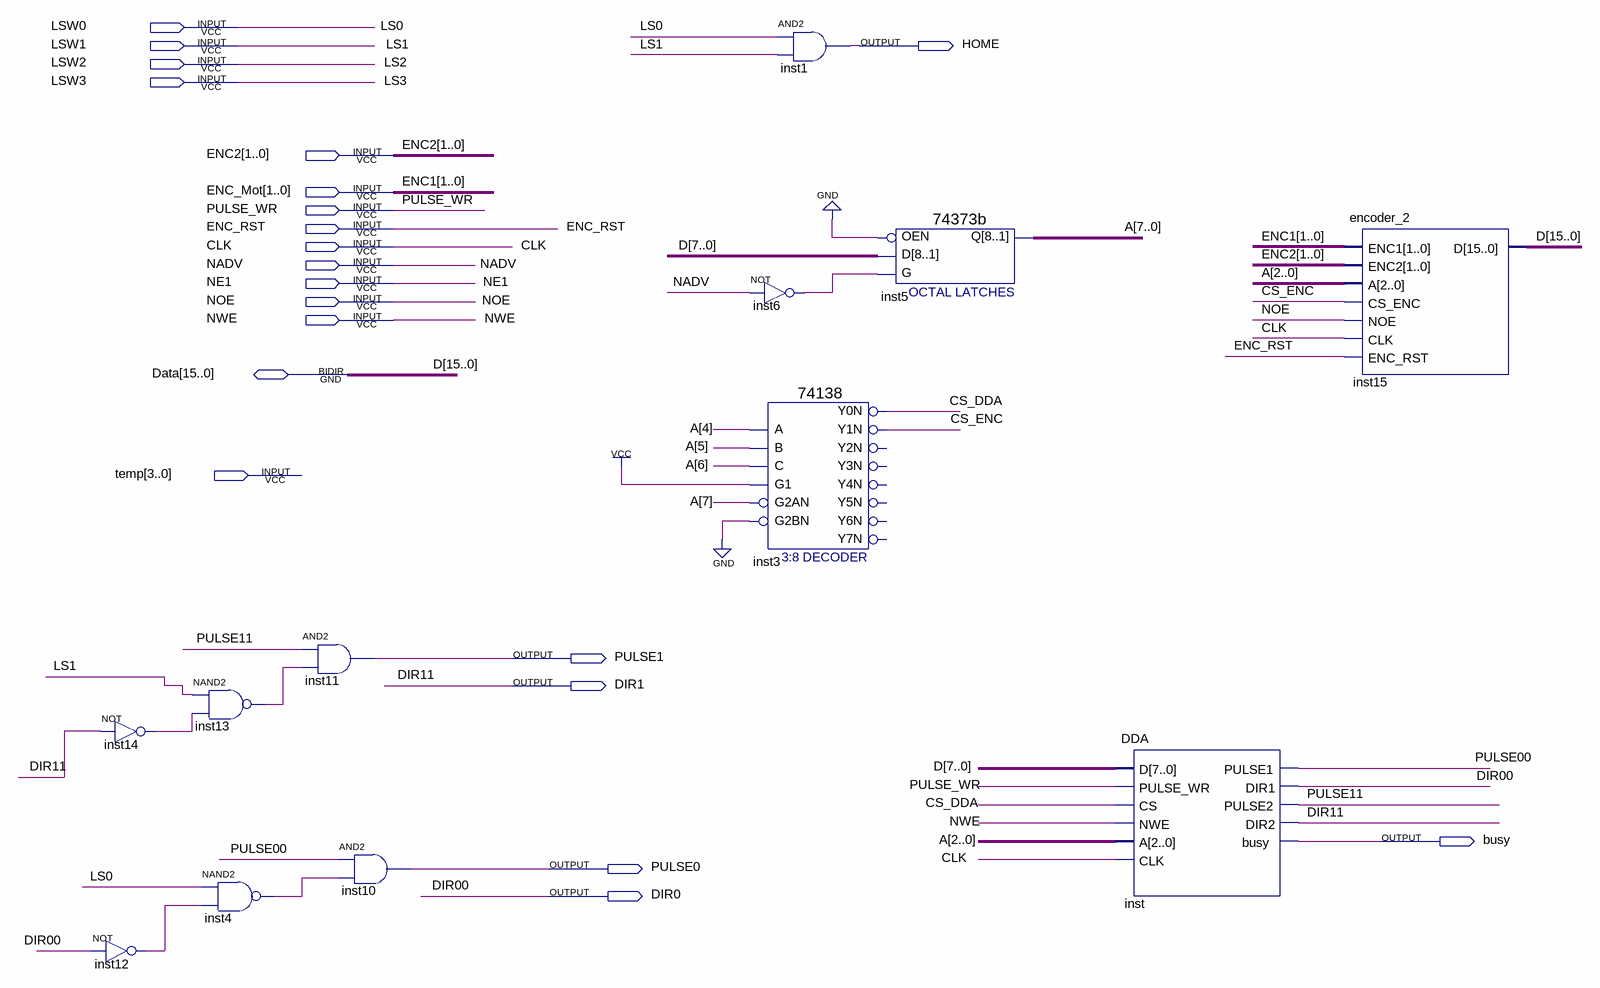
[diagram p0: schematic sheet]
// Quartus schematic xuat_xung.bdf as structural Verilog: 12 symbols, 21 pins
module xuat_xung (
  input  LSW0,
  input  LSW1,
  input  LSW2,
  input  LSW3,
  input  [1:0] ENC2,
  input  [1:0] ENC_Mot,
  input  PULSE_WR,
  input  ENC_RST,
  input  CLK,
  input  NADV,
  input  NE1,
  input  NOE,
  input  NWE,
  input  [3:0] temp,
  inout  [15:0] Data,
  output HOME,
  output PULSE1,
  output DIR1,
  output busy,
  output PULSE0,
  output DIR0
);

  wire CS_DDA, CS_ENC, inst4_out, inst6_out, inst12_out, inst13_out, inst14_out, PULSE00, PULSE11;
  wire [7:0] A;

  not inst12 (inst12_out, DIR0);
  not inst14 (inst14_out, DIR1);
  nand inst13 (inst13_out, LSW1, inst14_out);
  nand inst4 (inst4_out, LSW0, inst12_out);
  and inst11 (PULSE1, PULSE11, inst13_out);
  and inst10 (PULSE0, PULSE00, inst4_out);
  not inst6 (inst6_out, NADV);
  \74138  inst3 (
    .A(A[4]), .B(A[5]), .G1(1'b1), .C(A[6]), .G2AN(A[7]), .G2BN(1'b0), .Y0N(CS_DDA), .Y1N(CS_ENC));  // open: Y2N, Y3N, Y4N, Y5N, Y6N, Y7N
  and inst1 (HOME, LSW0, LSW1);
  \74373b  inst5 (.D(Data[7:0]), .G(inst6_out), .OEN(1'b0), .Q(A));
  DDA inst (
    .D(Data[7:0]), .PULSE_WR(PULSE_WR), .CS(CS_DDA), .NWE(NWE), .A(A[2:0]), .CLK(CLK), .PULSE1(PULSE00),
    .DIR1(DIR0), .PULSE2(PULSE11), .DIR2(DIR1), .busy(busy));
  encoder_2 inst15 (
    .ENC1(ENC_Mot), .ENC2(ENC2), .A(A[2:0]), .CS_ENC(CS_ENC), .NOE(NOE), .CLK(CLK), .ENC_RST(ENC_RST),
    .D(Data));

  // Other names for the same wires on the sheet: D[15:0] = Data; DIR00 = DIR0; DIR11 = DIR1; ENC1[1:0] = ENC_Mot;
  //   LS0 = LSW0; LS1 = LSW1; LS2 = LSW2; LS3 = LSW3
endmodule
